# EAGLE design SDR1806 (EAGLE 7.3.0)
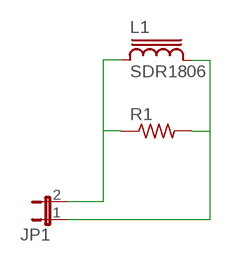
[diagram p0: schematic, sheet 1]

## Parts
JP1  JP1E  [JP1]
L1  SDR1806  [SDR1806]
R1  R-US_R0603  [R0603]

## Nets
N$3: JP1.2 L1.1 R1.1
N$4: JP1.1 L1.2 R1.2

## Library data of the parts
JP1 = jumper:JP1E: JUMPER
L1 = SDR1806:SDR1806: POWER INDUCTOR
R1 = rcl:R-US_: RESISTOR, American symbol

## Board
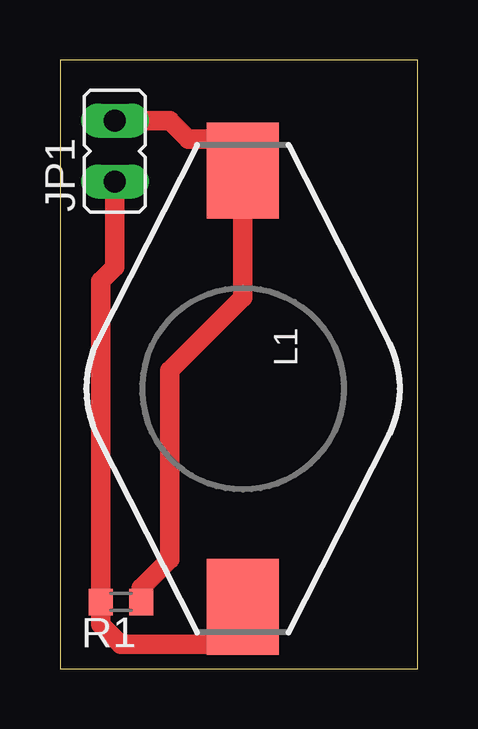
[diagram p1: board, top side]

Size 14.91 x 25.39 mm. Coordinates in mm from the lower left corner, seen from the top.
Outline: 0,0 14.91,0 14.91,25.39 0,25.39 0,0
Copper layers (1*16): Top 0.035mm / dielectric 1.5mm / Bottom 0.035mm
Design rules "default": minimum track width 10mil, minimum drill 24mil, track to track 8mil, track to pad 8mil, pad to pad 8mil, via to via 8mil, smd to smd 8mil, copper to edge 40mil, drill to drill 8mil, minimum pad ring 10mil, minimum via ring 8mil, stop-mask expansion 4mil, vias tented up to drill 0mil, thermal gap 10mil

### Footprints (pad centres in the part's own frame; a part is rotated, then mirrored left to right if it is on the bottom)
JP1 = drill 0.914 long: 1 0,-1.27; 2 0,1.27
SDR1806 = smd 4 x 3: 1 -9.09,0; 2 9.09,0
R0603 = smd 1 x 1.1: 1 -0.85,0; 2 0.85,0

### Placement (x,y rotation side)
JP1  2.29,21.59 0 top
L1  7.62,11.68 270 top
R1  2.54,2.79 180 top

### Tracks (layer width: path | path; a pad name or v marks a point on that pad's centre or on a via)
N$3
  Top 0.813: R1.1 3.39,3.39 4.57,4.57 4.57,12.45 7.62,15.49 L1.1 7.62,22.1 5.33,22.1 4.57,22.86 JP1.2
N$4
  Top 0.813: JP1.1 2.29,16.76 1.69,16.17 R1.2 1.69,1.87 2.54,1.02 6.6,1.02 6.99,1.4 7.11,1.52 7.11,2.09 L1.2